# EAGLE design Adafruit VCNL4200 Long Distance IR Sensor Breakout (EAGLE 9.6.2)
COMPANY: ADAFRUIT INDUSTRIES; DRAWN: KTOWN; REV: A
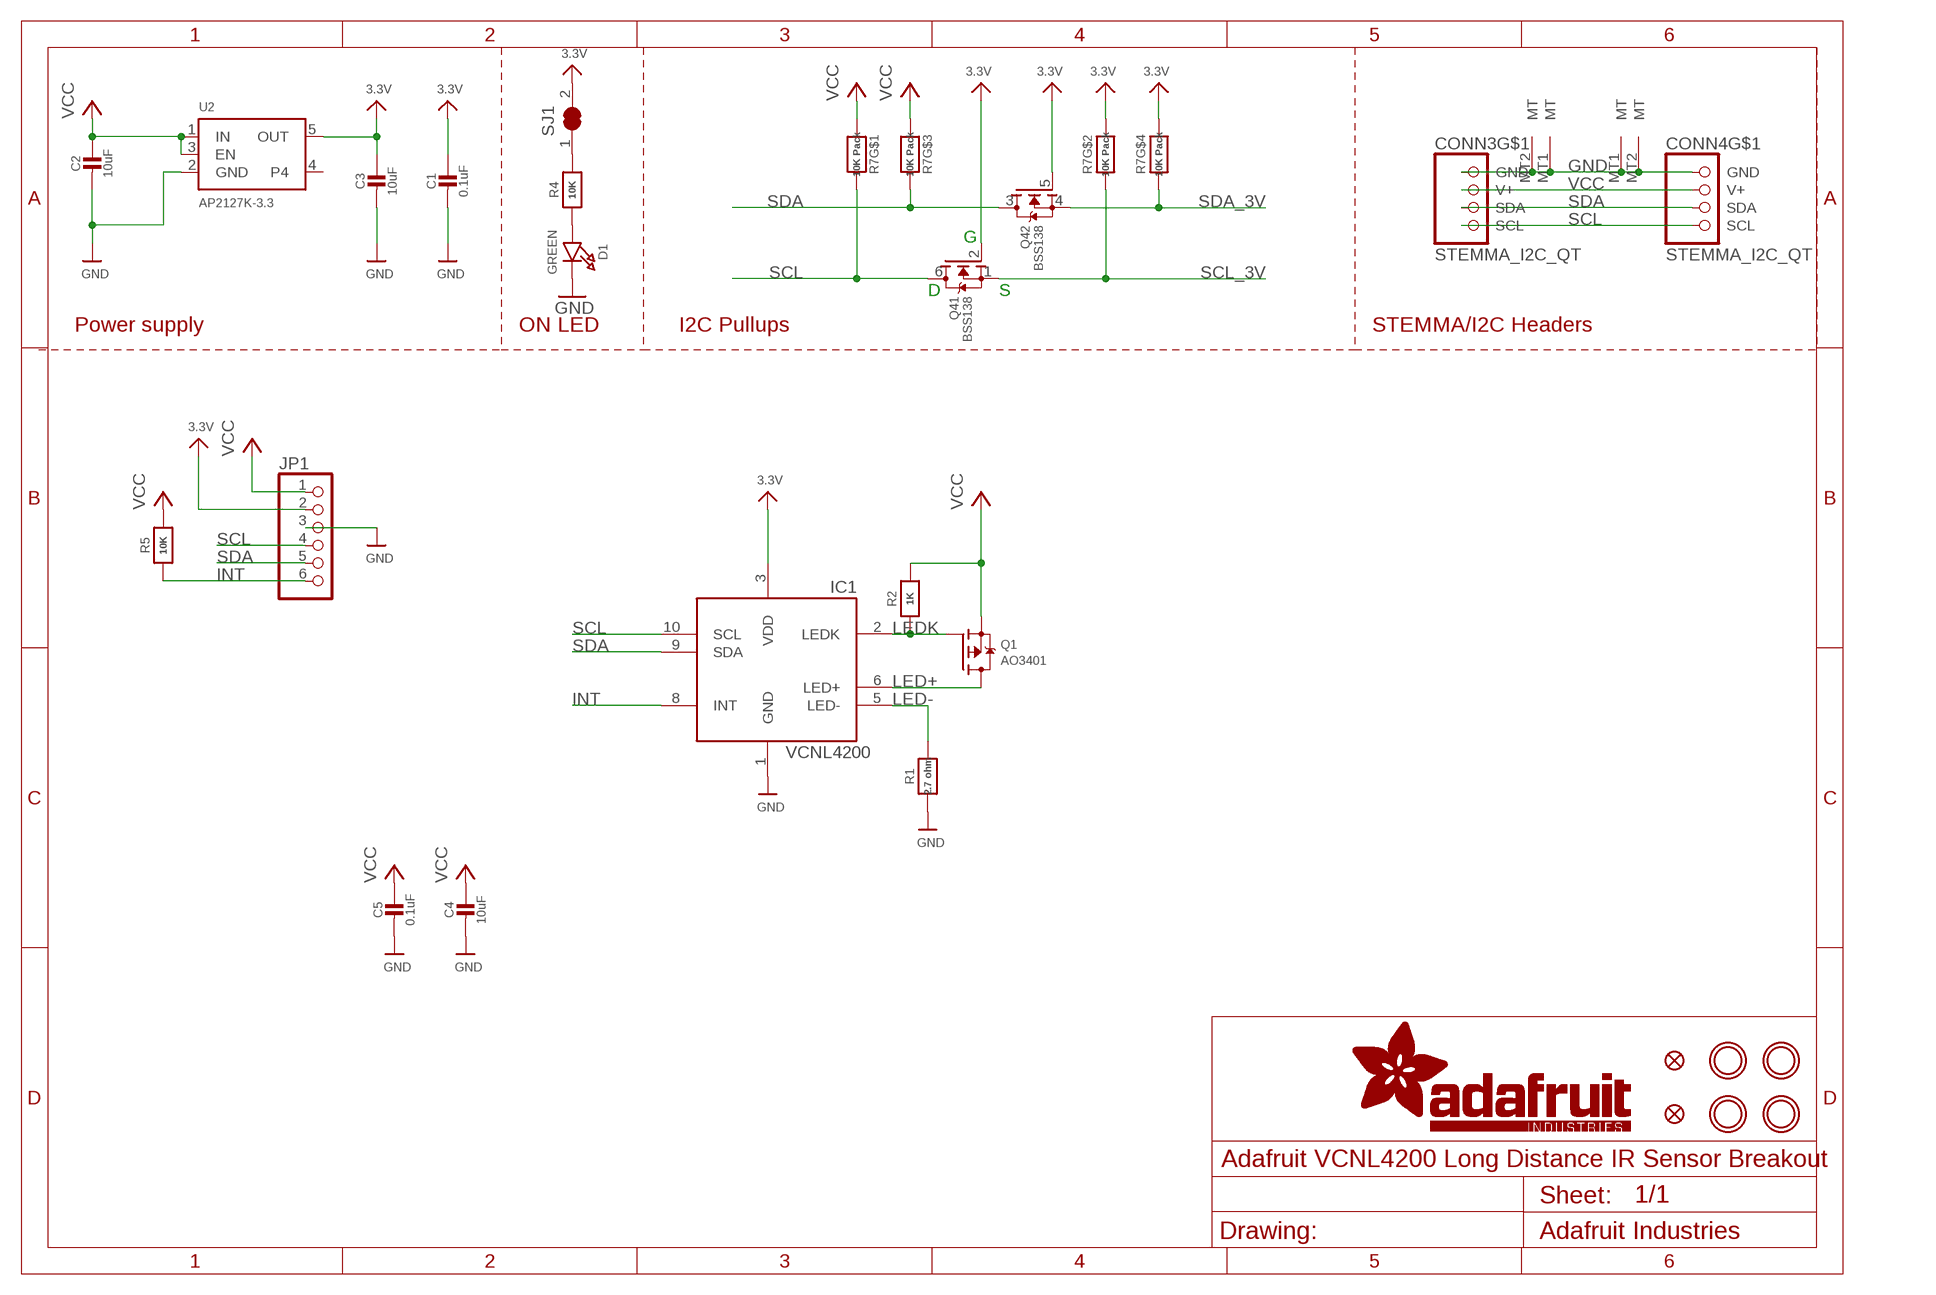
[diagram p0: schematic, sheet 1]

## Parts
C1  0.1uF  CAP_CERAMIC0603_NO  [0603-NO]
C2  10uF  CAP_CERAMIC0805-NOOUTLINE  [0805-NO]
C3  10uF  CAP_CERAMIC0805-NOOUTLINE  [0805-NO]
C4  10uF  CAP_CERAMIC0805-NOOUTLINE  [0805-NO]
C5  0.1uF  CAP_CERAMIC0603_NO  [0603-NO]
CONN3  STEMMA_I2C_QT  [JST_SH4]
CONN4  STEMMA_I2C_QT  [JST_SH4]
D1  GREEN  LED0603_NOOUTLINE  [CHIPLED_0603_NOOUTLINE]
FID3  FIDUCIAL_1MM  [FIDUCIAL_1MM]
FID4  FIDUCIAL_1MM  [FIDUCIAL_1MM]
IC1  VCNL4200  [VCNL4200]
JP1  HEADER-1X670MIL  [1X06_ROUND_70]
Q1  AO3401  MOSFET-PWIDE  [SOT23-WIDE]
Q4  BSS138  MOSFET-N_DUAL  [SOT363]
R1  2.7 ohm  RESISTOR_0603_NOOUT  [0603-NO]
R2  1K  RESISTOR_0603_NOOUT  [0603-NO]
R4  10K  RESISTOR_0603_NOOUT  [0603-NO]
R5  10K  RESISTOR_0603_NOOUT  [0603-NO]
R7  10K Pack  RESISTOR_4PACK  [RESPACK_4X0603]
SJ1  SOLDERJUMPER_CLOSED  [SOLDERJUMPER_CLOSEDWIRE]
U2  AP2127K-3.3  VREG_SOT23-5  [SOT23-5]
U$1  MOUNTINGHOLE2.5  [MOUNTINGHOLE_2.5_PLATED]
U$17  MOUNTINGHOLE2.5  [MOUNTINGHOLE_2.5_PLATED]
U$19  MOUNTINGHOLE2.5  [MOUNTINGHOLE_2.5_PLATED]
U$21  MOUNTINGHOLE2.5  [MOUNTINGHOLE_2.5_PLATED]

## Nets
3.3V: C1.1 C3.1 IC1.3(VDD) JP1.2 Q4.2(1:G) Q4.5(2:G) R7.2 R7.4 SJ1.2 U2.5(OUT)
GND: C1.2 C2.2 C3.2 C4.2 C5.2 CONN3.1(GND) CONN3.MT1(MT) CONN3.MT2(MT) CONN4.1(GND) CONN4.MT1(MT) CONN4.MT2(MT) D1.C IC1.1(GND) JP1.3 R1.1 U2.2(GND)
INT: IC1.8(INT) JP1.6 R5.1
LED+: IC1.6(LED+) Q1.3(D)
LED-: IC1.5(LED-) R1.2
LEDK: IC1.2(LEDK) Q1.1(G) R2.1
N$1: D1.A R4.1
N$2: R4.2 SJ1.1
SCL: CONN3.4(SCL) CONN4.4(SCL) IC1.10(SCL) JP1.4 Q4.6(1:D) R7.8
SCL_3V: Q4.1(1:S) R7.7
SDA: CONN3.3(SDA) CONN4.3(SDA) IC1.9(SDA) JP1.5 Q4.3(2:D) R7.6
SDA_3V: Q4.4(2:S) R7.5
VCC: C2.1 C4.1 C5.1 CONN3.2(V+) CONN4.2(V+) JP1.1 Q1.2(S) R2.2 R5.2 R7.1 R7.3 U2.1(IN) U2.3(EN)
Unconnected: U2.4

## Notes on the sheet
- G
- D | S
- Power supply | ON LED | I2C Pullups | STEMMA/I2C Headers

## Library data of the parts
C1-C5 = microbuilder:CAP_CERAMIC: Ceramic Capacitors For new designs, use the packages preceded by an '_' character since they are more reliable: The following footprints should be used on most boards: _0402 - Standard footprint for regular board layouts _0603 - Standard footprint for regular board layouts _0805 - Standard footprint for regular board layouts _1206 - Standard footprint for regular board layouts For extremely tight-pitch boards where space is at a premium, the following 'micro-pitch' footprints can be used (smaller pads, no silkscreen outline, etc.): _0402MP - Micro-pitch footprint for very dense/compact boards _0603MP - Micro-pitch footprint for very dense/compact boards _0805MP - Micro-pitch footprint for very dense/compact boards _1206MP - Micro-pitch footprint for very dense/compact boards
CONN3 CONN4 = adafruit_electromech:STEMMA_I2C; LCSC: C2845363
D1 = microbuilder:LED: LED 0603 - 0603 Surface Mount Package 2mA: Green LED - Low Power (3.9mcd, 2ma, 1.7Vf) - Digikey: 475-2709-2-ND Orange LED - Low Power (9.8mcd, 2ma, 1.8Vf) - Digikey: 475-1194-2-ND Red LED - Low Power (5mcd, 2ma, 1.8Vf) - Digikey: 475-1195-2-ND Yellow LED - Low Power (7mcd, 2ma, 1.8Vf) - Digikey: 475-1196-2-ND 5mA: Blue LED - Low Power (17mcd, 5ma, 2.9Vf) - Digikey: LNJ937W8CRACT-ND 0805 - 0805 Surface Mount Package 2mA: Red LED (8.8mcd, 2mA, 1.8Vf, Clear) - Low Power [Digikey: 475-2510-1-ND] Green LED (5mcd, 2mA, 1.8Vf, Clear) - Low Power [Digikey: 475-2730-1-ND] Yellow LED (11.3mcd, 2mA, 1.8Vf, Clear) - Low Power [Digikey: 475-2555-1-ND] 20mA: Red LED (104mcd, 20mA, Diffused) - LS R976 [Digikey: 475-1278-6-ND] Red LED (12mcd, 20mA, 2.0Vf, Clear) - APT2012EC [Digikey: 754-1128-1-ND] Green LED (15mcd, 20mA, 2.2Vf, Clear) - APT2012GC [Digikey: 754-1131-1-ND] Orange LED (160mcd, 20mA, 2.1Vf, Clear) - APT2012SECK [Digikey: 754-1130-1-ND] 1206 - 1206 Surface Mount Package Green LED (26mcd, 20mA, Diffused) - LG N971 [Digikey: 475-1407-6-ND] Red LED (15mcd, 20mA, Diffused) - LH N974 [Digikey: 475-1416-6-ND] Cree - Cree High-Power Surface Mount LEDs XPEBWT-L1-0000-00D50 - White 111lm 350mA 2.9Vf 6200K 110° XTEAWT-00-0000-00000LEE3 - White 114lm 350mA 2.85Vf 5000K 115° Everlight - Everlight 45-21 Series Surface Mount LEDs 45-21/QK2C-B2832AC2CB2/2T - Warm White 2000mcd 20mA 3.25Vf 3050K 120° 45-21/LK2C-B38452C4CB2/2T - Nuetral White 2000mcd 20mA 3.25Vf 4150K 120° 45-21/LK2C-B50634C6CB2/2T - Cold White 2200mcd 20mA 3.25Vf 5650K 120° PLCC2 Reverse Mount LS T77K-J1L2-1-0-2-R18-Z - Red 11.25mcd 2mA 1.8Vf 630nm 120° LO T77K-L1M2-24-Z - Orange 19.6mcd 2mA 1.8Vf 606nm 120° LY T77K-K2M1-26-Z - Yellow 15.7mcd 2mA 1.8Vf 587nm 120°; ROT: 270
FID3 FID4 = microbuilder:FIDUCIAL: Fiducial Alignment Points Various fiducial points for machine vision alignment.; BOM: EXCLUDE
IC1 = adafruit_sensor:VCNL4200
JP1 = microbuilder:HEADER-1X6: PIN HEADER
Q1 = microbuilder:MOSFET-P: P-Channel Mosfet LEGEND VDS: Voltage Drain-Source ID: Drain Current RDS(ON): Drain-Source On-State Resistance VGS(TH): Gate-Source Threshold Voltage CISS: Drain-Source Input Capacitance SOT-23 Name VDS ID RDS(ON) VGS(TH) CISS Order Number IRLML5103 30V 760mA 600 mOhm -- 75pF @ 25V Digikey: IRLML5103PBFCT-ND IRLML6401 12V 4.3A 50 mOhm 950mV @ 250µA 830pF @ 10V Digikey: IRLML6401PBFTR-ND NTR0202PL 20V 400mA 800 mOhm 2.3V @ 250uA 70pF @ 5V Digikey: NTR0202PLT1GOSTR-ND NTR4101PT1G 20V 1.8A 85 mOhm 1.2V @ 250uA 675pF @ 10V Digikey: NTR4101PT1GOSCT-ND DMP2004K 20V 600mA 900 mOhm 1V @ 250uA 175pF @ 16V Digikey: DMP2004KDICT-ND PMV65XP 20V 3.9A 76 mOhm 950mV @ 1mA 725pF @ 20V Digikey: 568-2358-2-ND TO-252 Name VDS ID RDS(ON) VGS(TH) CISS Order Number AOD417 30V 25A 34 mOhm 3V @ 250µA 920pF @ 15V Digikey: 785-1106-2-ND PowerPak Name VDS ID RDS(ON) VGS(TH) CISS Order Number AON7401 30V 12A 14 mOhm 3V @ 250µA 2600pF @ 15V Digikey: 785-1302-1-ND
Q4 = microbuilder:MOSFET-N_DUAL: Dual N-Channel MOSFET SOT363 (2.0x1.25mm) 2N7002PS - 60V, 320mA [Digikey: 568-5984-1-ND]; JLC_ROTATION: 270
R1 R2 R4 R5 = microbuilder:RESISTOR: Resistors For new designs, use the packages preceded by an '_' character since they are more reliable: The following footprints should be used on most boards: _0402 - Standard footprint for regular board layouts _0603 - Standard footprint for regular board layouts _0805 - Standard footprint for regular board layouts _1206 - Standard footprint for regular board layouts For extremely tight-pitch boards where space is at a premium, the following 'micro-pitch' footprints can be used (smaller pads, no silkscreen outline, etc.): _0402MP - Micro-pitch footprint for very dense/compact boards _0603MP - Micro-pitch footprint for very dense/compact boards _0805MP - Micro-pitch footprint for very dense/compact boards _1206MP - Micro-pitch footprint for very dense/compact boards
R7 = microbuilder:RESISTOR_4PACK: Resistor Packs (4 resistors) 4 x 0603 10K 1/16W - Digikey: YC164J-10KCT-ND
SJ1 = microbuilder:SOLDERJUMPER_CLOSED: Solder Jumper - Closed These solder jumpers are closed by default CLOSEDWIRE - 10 mil trace between pads that can be cut and resoldered later CLOSEDPERM - 63 mil trace between pads for a permanent connection (used to 'bridge' two signals, a shameless hack for Eagle). Can double as a test point as well (no cream layer)
U2 = adafruit_power:VREG_SOT23-5: SOT23-5 Fixed Voltage Regulators Part Current Out V Out V In V Dropout θJA (°C/W) TJ (°C) Digikey Part No. ADP121 150mA 3.3V 3.4-5.5V 0.09V @ 150mA -- -- ADP121-AUJZ33R7CT-ND ADP121 150mA 3.0V 3.1-5.5V 0.09V @ 150mA -- -- ADP121-AUJZ30R7CT-ND ADP122 300mA 3.3V 3.4-5.5V 0.085V @ 300mA -- -- ADP122AUJZ-3.3-R7CT-ND ADP1712 300mA 3.3V 3.5-5.5V 0.17V @ 300mA -- -- ADP1712AUJZ-3.3-R7TR-ND AP7311 (Low Cost) 150mA 3.3V 3.5-6V 0.15V @ 150mA -- -- AP7311-33WG-7DICT-ND LD39015M18R 150mA 1.8V 1.9V-5.5V 0.08V @ 100mA -- -- 497-6977-1-ND LP2985A-33DBVR 150mA 3.3V 3.3-16V 0.28V @ 150mA 206 150 296-18479-1-ND MCP1824T-3302E/OT 300mA 3.3V 3.5V-6V 0.2V @ 300mA -- -- MCP1824T-3302E/OTCT-ND MIC5205-2.5YM5 TR 150mA 2.5V 2.7-16V 0.165V @ 150mA -- -- 576-1257-2-ND MIC5205-3.0YM5 TR 150mA 3.0V 3.2V-16V 0.165V @ 150mA -- -- 576-1258-2-ND MIC5205-3.3YM5 TR 150mA 3.3V 3.5V-16V 0.165V @ 150mA -- -- 576-1259-2-ND TPS780330220 150mA 3.3V+2.2V 3.6-5.5V 250mV Max -- -- 296-23332-1-ND TDA3663/N1,135 100mA 3.3V 3.5-45V 0.18V @ 50mA -- -- 568-5343-1-ND Max operating temp can be calculated using θJA, TJ (max junction temperature), and power in watts. Set the "Maximum Ambient Temperature" until it reaches TJ ("Max Junction Temperature"), which is the absolute limit for safe use of the regulator: Heat Sink Temperature Calculator <http://www.daycounter.com/Calculators/Heat-Sink-Temperature-Calculator.phtml> For example, With 12V source into a 3.3V LP2985 and a 30mA load, we are dissipating (12V-3.3V) * 0.03A = 0.261W. With a θJA of 206 °C/W, a TJ of 150°C, and 261mW we can safely use the chip without a heat sink up to 75°C (=147.1°C Junction Temperature).; JLC_ROTATION: 270
U$1 U$17 U$19 U$21 = adafruit_electromech:MOUNTINGHOLE: Mounting Hole For #2 screws (0.086"/2.18mm width, 0.094"/2.4mm hole) use 2.5mm; BOM: EXCLUDE

## Board
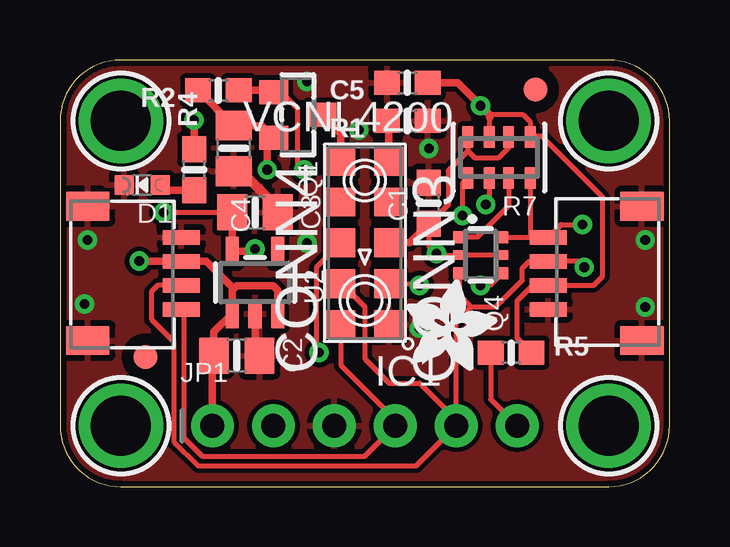
[diagram p1: board, top side]
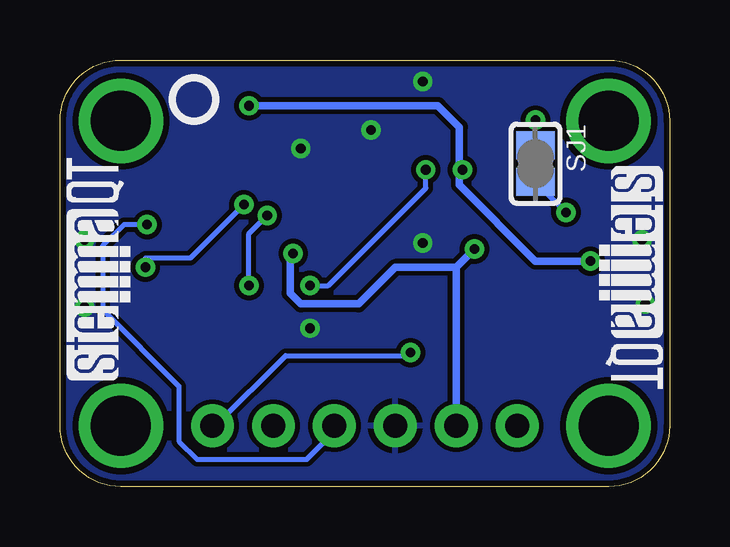
[diagram p2: board, bottom side, seen from below]

Size 25.4 x 17.78 mm. Coordinates in mm from the lower left corner, seen from the top.
Outline: 0,15.24 0,2.54 arc90 2.54,0 22.86,0 arc90 25.4,2.54 25.4,15.24 arc90 22.86,17.78 2.54,17.78 arc90 0,15.24
Copper layers (1*16): Top 0.035mm / dielectric 1.5mm / Bottom 0.035mm
Design rules "adafruit *": minimum track width 8mil, minimum drill 15.5mil, track to track 8mil, track to pad 8mil, pad to pad 8mil, via to via 8mil, smd to smd 8mil, copper to edge 10mil, drill to drill 8mil, minimum pad ring 10mil, minimum via ring 8mil, stop-mask expansion 2mil, vias tented up to drill 20mil, thermal gap 10mil

### Footprints (pad centres in the part's own frame; a part is rotated, then mirrored left to right if it is on the bottom)
0603-NO = smd 1.075 x 1: 1 -0.85,0; 2 0.85,0
0805-NO = smd 1.24 x 1.5: 1 -0.95,0; 2 0.95,0
JST_SH4 = smd 0.6 x 1.55: 1 -1.5,2.006; 2 -0.5,2.006; 3 0.5,2.006; 4 1.5,2.006 | smd 1.2 x 1.8: MT1 -2.8,-1.894; MT2 2.8,-1.894
CHIPLED_0603_NOOUTLINE = smd 0.8 x 0.8: A 0,-0.75; C 0,0.75
FIDUCIAL_1MM = smd 1 x 1: 1 0,0
VCNL4200 = smd 1.2 x 1.2: 1 -1,3.4; 2 -1,1.7; 3 -1,0; 4 -1,-1.7; 5 -1,-3.4; 6 1,-3.4; 7 1,-1.7; 8 1,0; 9 1,1.7; 10 1,3.4
1X06_ROUND_70 = drill 1 pad 1.778: 1 -6.35,0; 2 -3.81,0; 3 -1.27,0; 4 1.27,0; 5 3.81,0; 6 6.35,0
SOT23-WIDE = smd 1 x 1.2: 1 -0.95,-1; 2 0.95,-1; 3 0,1
SOT363 = smd 0.5 x 0.5: 1 -0.75,-0.9; 3 0.75,-0.9; 4 0.75,0.9; 6 -0.75,0.9 | smd 0.4 x 0.5: 2 0,-0.9; 5 0,0.9
RESPACK_4X0603 = smd 0.45 x 0.9: 1 -1.3,-0.85; 2 -0.4,-0.85; 3 0.4,-0.85; 4 1.3,-0.85; 5 1.3,0.85; 6 0.4,0.85; 7 -0.4,0.85; 8 -1.3,0.85
SOLDERJUMPER_CLOSEDWIRE = smd 1.168 x 1.6: 1 -0.762,0; 2 0.762,0 | smd 0.635 x 0.203: WIRE 0,0
SOT23-5 = smd 0.55 x 1.2: 1 -0.95,-1.3; 2 0,-1.3; 3 0.95,-1.3; 4 0.95,1.3; 5 -0.95,1.3
MOUNTINGHOLE_2.5_PLATED = drill 2.5 pad 3.2: P$1 0,0

### Placement (x,y rotation side)
C1  15.37,11.81 90 top
C2  7.37,5.46 0 top
C3  8.13,11.43 0 top
C4  7.24,14.1 270 top
C5  14.48,16.83 180 top
CONN3  22.35,8.89 90 top
CONN4  3.05,8.89 270 top
D1  3.43,12.57 90 top
FID3  3.56,5.4 0 top
FID4  19.81,16.55 0 top
IC1  12.7,10.16 180 top
JP1  12.7,2.54 0 top
PLABEL0  [PLABEL0]  6.35,0.89 0 top
PLABEL1  [PLABEL1]  8.89,4.19 0 top
PLABEL2  [PLABEL2]  11.43,0.89 0 top
PLABEL3  [PLABEL3]  13.97,4.19 0 top
PLABEL4  [PLABEL4]  16.64,0.89 0 top
PLABEL5  [PLABEL5]  19.05,4.19 0 top
PLABEL6  [PLABEL6]  0.51,12.45 0 top
PLABEL7  [PLABEL7]  13.34,13.34 0 bottom
PLABEL8  [PLABEL8]  5.71,16.26 0 bottom
PLABEL9  [PLABEL9]  12.57,7.62 0 bottom
PLABEL10  [PLABEL10]  12.45,0.89 0 bottom
Q1  9.91,15.49 270 top
Q4  17.53,9.65 270 top
R1  14.48,15.24 180 top
R2  6.6,16.51 180 top
R4  5.59,13.21 90 top
R5  18.8,5.59 0 top
R7  18.29,13.72 180 top
SJ1  5.59,13.46 270 bottom
U2  8.13,8.51 0 top
U$1  2.54,15.24 0 top
U$17  22.86,15.24 0 top
U$19  2.54,2.54 0 top
U$21  22.86,2.54 0 top
U$22  [ADAFRUIT_3.5MM]  14.41,4.83 0 top
U$25  [PCBFEAT-REV-040]  19.81,16.13 0 bottom
U$30  [STEMMAQT]  22.48,4.45 90 bottom
U$31  [STEMMAQT]  2.92,13.34 270 bottom

### Tracks (layer width: path | path; a pad name or v marks a point on that pad's centre or on a via)
3.3V  (via drill 0.4)
  Top 0.203: Q4.5 Q4.2 15.75,9.65 v15.68,9.72 15.37,10.03 C1.1 15.39,10.96 16.17,11.74 16.17,13.16 16.99,13.97 R7.4 16.99,14 17.27,13.72 18.29,13.72 18.69,14.12 R7.2 | v4.32,11.43 6.92,11.43
  Top 0.305: 7.18,11.18 U2.5 8.03,9.81 v8.13,9.91 | 7.18,11.18 C3.1 | 6.92,11.43 7.18,11.18 | C1.1 14.57,10.16 IC1.3
  Bottom 0.203: SJ1.2 v4.32,11.43
  Bottom 0.305: JP1.2 8.89,9.14 | v8.13,9.91 8.89,9.14 | 8.89,9.14 11.43,9.14 12.95,7.62 15.37,7.62 15.81,8.06 15.81,9.59 v15.68,9.72
GND  (via drill 0.4)
  Top 0.305: U2.2 8.13,5.65 C2.2
  Top 0.406: C4.2 7.55,13.15 8.3,12.4 9.08,11.62 C3.2
  other vias: 1.14,10.29 1.02,7.62 10.29,10.16 10.29,16.89 14.99,6.6 24.38,7.49 24.38,10.29 15.37,14.1 12.45,14.86
  pour Top: 0,17.78 25.4,17.78 25.4,0 0,0
  pour Bottom: 0,17.78 25.4,17.78 25.4,0 0,0
INT  (via drill 0.4)
  Top 0.203: R5.1 17.95,3.64 JP1.6 | IC1.8 10.68,9.14 10.68,5.7 v10.79,5.59
  Bottom 0.203: v10.79,5.59 10.92,5.46 16,5.46 18.92,2.54 JP1.6
LED+
  Top 0.305: Q1.3 11.7,14.7 IC1.6
LED-
  Top 0.305: R1.2 13.7,15.17 IC1.5
LEDK  (via drill 0.4)
  Top 0.203: IC1.2 14.91,8.46 v14.99,8.38 | v10.16,13.21 9.91,13.46 9.91,15.75 9.21,16.44 Q1.1
  Top 0.305: R2.1 8.84,16.51 Q1.1
  Bottom 0.203: v14.99,8.38 14.22,8.38 10.16,12.45 v10.16,13.21
N$1
  Top 0.305: R4.1 4.39,12.36 D1.A
N$2  (via drill 0.4)
  Top 0.305: v5.59,15.28 R4.2
  Bottom 0.203: SJ1.1 v5.59,15.28
SCL  (via drill 0.4)
  Top 0.203: IC1.10 11.7,5.06 13.72,3.05 13.72,2.79 13.84,2.67 | 13.84,2.67 JP1.4 | CONN4.4 5.16,7.29 5.16,2.05 5.93,1.27 12.7,1.27 13.84,2.41 13.84,2.67 | Q4.6 19.56,10.4 | 19.56,10.4 20.33,10.4 CONN3.4 20.88,10.92 v21.77,10.92 | R7.8 19.59,10.43 19.56,10.4
  Bottom 0.203: v21.77,10.92 22.73,10.92 23.62,10.03 23.62,7.37 20.45,4.19 20.45,1.91 19.68,1.14 15.11,1.14 13.97,2.29 JP1.4
SCL_3V
  Top 0.203: R7.7 18.69,11.7 17.39,10.4 Q4.1
SDA  (via drill 0.4)
  Top 0.203: IC1.9 11.73,8.46 12.7,7.49 12.7,5.33 13.72,4.32 14.99,4.32 16.51,2.79 JP1.5 | CONN4.3 4.07,8.39 3.81,8.13 3.81,6.99 4.75,6.04 4.75,1.88 5.76,0.86 14.83,0.86 JP1.5 | 17.14,7.49 16.63,8.01 Q4.3 | 17.14,7.49 18.16,7.49 19.27,8.6 19.27,9.11 19.55,9.39 CONN3.3 21.6,9.39 v21.84,9.14 | JP1.5 16.51,6.86 17.14,7.49 | R7.6 17.89,11.9 v17.74,11.76
  Bottom 0.203: v17.74,11.76 19.97,9.53 21.84,9.53 v21.84,9.14
SDA_3V  (via drill 0.4)
  Top 0.203: Q4.4 17.91,8.38 v17.53,8.38 | R7.5 16.76,12.64 v16.76,11.3
  Bottom 0.203: v17.53,8.38 17.53,10.54 v16.76,11.3
VCC  (via drill 0.4)
  Top 0.203: R5.2 19.05,6.18 19.05,7.75 19.69,8.39 CONN3.2 22.23,8.39 22.61,8.76 22.61,12.06 20.07,14.61 19.59,14.61 | R7.3 17.89,15.35 17.91,15.37 18.03,15.49 19.3,15.49 19.59,15.21 19.59,14.61 | 19.59,14.61 R7.1
  Top 0.305: JP1.1 6.35,5.39 C2.1 6.42,6.45 U2.1 7.18,8.19 | 7.18,8.19 7.37,8.38 8.89,8.38 9.08,8.19 U2.3 | 7.18,8.19 7.18,8.32 6.1,9.39 CONN4.2 v3.31,9.39 v3.3,9.4 | 8.64,14.81 8.4,15.05 C4.1 7.22,15.05 R2.2 | 8.64,14.81 Q1.2 | v8.64,13.21 8.64,14.81 | 17.91,15.37 17.91,15.49 v17.53,15.88 16.57,16.83 C5.1
  Bottom 0.305: v3.3,9.4 5.59,9.4 8.76,12.57 8.76,13.08 | v8.64,13.21 8.76,13.08 | 8.76,13.08 8.76,14.99 9.65,15.88 v17.53,15.88

### Text on the board
Pinguin_tBackup: on | 3Vo | SCL | INT | VIN | GND | SDA
Pinguin_bBackup: LED | VCNL4020 | VCNL4020C | VCNL4200 | Proximity & / Ambient Light Sensor | 940nm IR Proximity / & Light Sensor / Up to ~1.5m distance / I2C addr 0x51 | VLogic/Vcc: 3-5VDC / I2C Address: 0x13 | Vcc/Vlogic: 3.3~5VDC